# EAGLE schematic BUZZER (EAGLE 9.6.2)
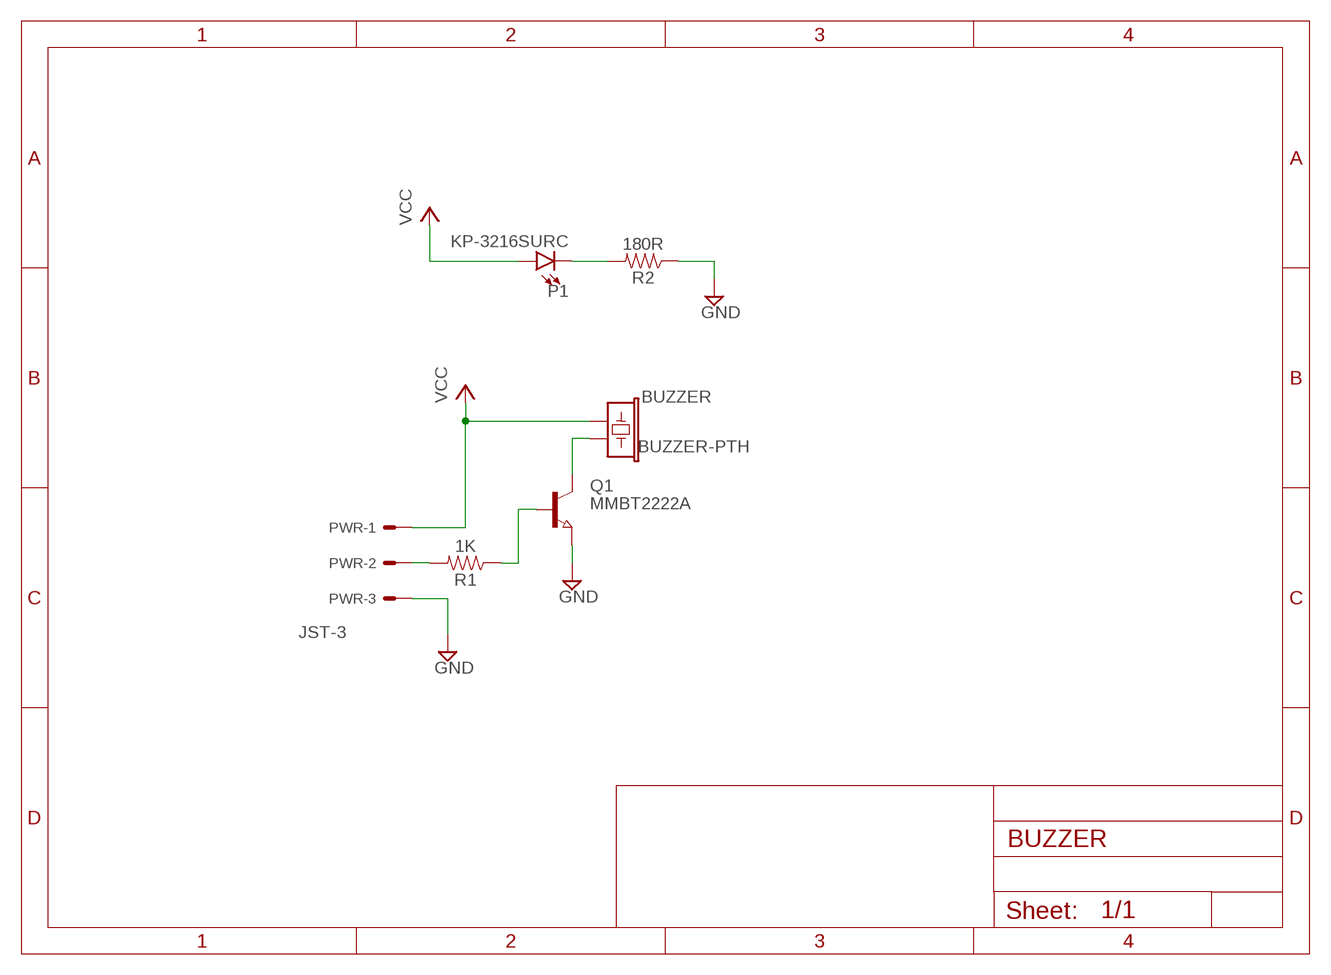
[diagram p0: schematic, sheet 1]

## Parts
BUZZER  BUZZER-PTH  [BUZZER-12MM]
P1  KP-3216SURC  LED_1206  [LED_1206_BOSON]
PWR  JST-3  JST-XH-03-PIN-LONG-PAD  [JST-XH-03-PACKAGE-LONG-PAD]
Q1  MMBT2222A  SOT-23_MMBT  [SOT_23_MMBT]
R1  1K  RESISTOR1206  [1206]
R2  180R  RESISTOR1206  [1206]

## Nets
GND: PWR.3 Q1.E R2.1
N$1: P1.P$2(C) R2.2
N$2: BUZZER.- Q1.C
N$3: PWR.2 R1.2
SIGNAL: Q1.B R1.1
VCC: BUZZER.+ P1.P$1(A) PWR.1

## Library data of the parts
BUZZER = boson:BUZZER: Buzzer Small round buzzers that operate around the audible 2kHz range. You can use these as speakers to create simple music or user interfaces. Variant Overview: PTH - Mini Speaker - PC Mount 12mm 2.048kHz <https://www.sparkfun.com/products/7950> PTH_KIT - Mini Speaker - PC Mount 12mm 2.048kHz <https://www.sparkfun.com/products/7950> KIT simplifies soldering by adding stop mask to one side of the pads. PTH_NO_SILK - Mini Speaker - PC Mount 12mm 2.048kHz <https://www.sparkfun.com/products/7950> No silkscreen indicator of buzzer outline. PTH_KIT_NO_SILK - Mini Speaker - PC Mount 12mm 2.048kHz <https://www.sparkfun.com/products/7950> KIT package w/o silkscreen SMD - Buzzer Audio Magnetic (CCV-084B16) SMD buzzer used on, e.g. the LilyPad Buzzer <https://www.sparkfun.com/products/8463> and RFID USB Reader <https://www.sparkfun.com/products/9963>. SMD_KIT - Buzzer Audio Magnetic (CCV-084B16) SMD Buzzer with elongated pins to make soldering easier. Used on the SparkFun Simon Says - Surface Mount Soldering Kit <https://www.sparkfun.com/products/10935>.; PROD_ID: COMP-08253; SF_SKU: COM-07950
P1 = boson:LED_1206; MANUFACTURER: Kingbright; PART_NO: KP-3216SURC
PWR = Rembrandt Electronics - JST XH Connectors v1-0:JST-XH-03-PIN: JST XH Connector 2 Pin Wire to board connector. Pitch: 2,54 mm, (0.100") Number of pins: 3 Created by Rembrandt Electronics www.rembrandtelectronics.com
Q1 = boson:SOT-23_MMBT; MANUFACTURER: DIODES INC; PART_NO: MMBT2222A
R1 = boson:RESISTOR: Generic Resistor Package; MANUFACTURER: RoyalOhm; PART_NO: 1206S4J0102T5E
R2 = boson:RESISTOR: Generic Resistor Package; MANUFACTURER: TE Connectivity; PART_NO: CRG1206F180R